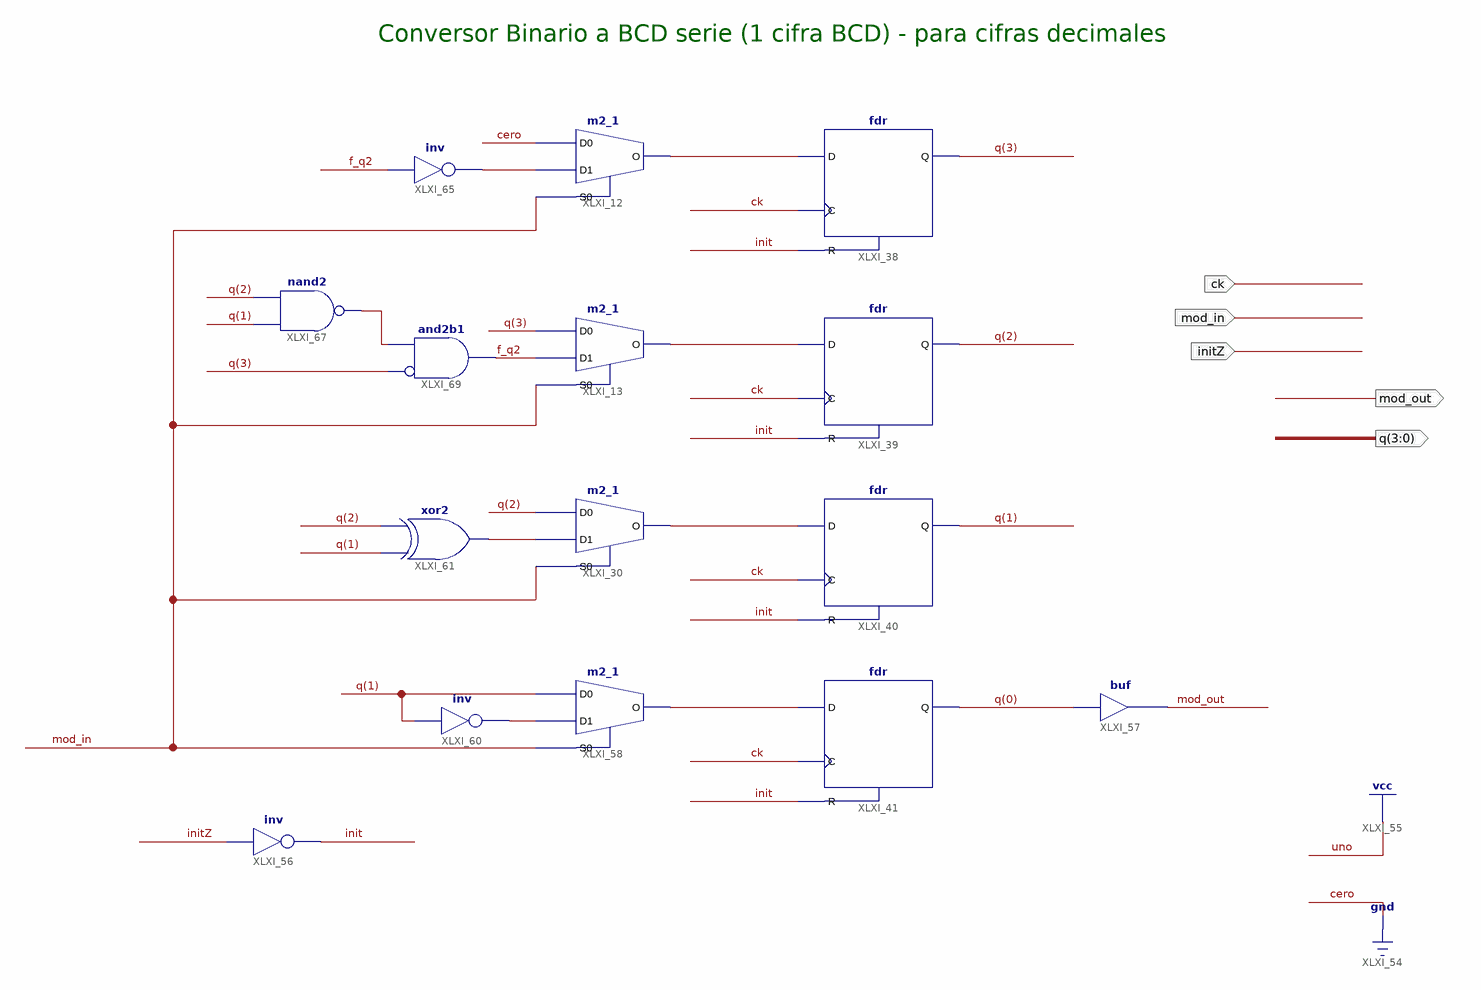
[diagram p0: schematic sheet 1]
// Xilinx ISE schematic Bin_A_BCD_decim.sch (spartan6) as structural Verilog: 15 symbols, 5 ports
module Bin_A_BCD_decim (
  input  initZ,
  input  ck,
  input  mod_in,
  output mod_out,
  output [3:0] q
);

  wire f_q2, init, XLXN_6, XLXN_7, XLXN_8, XLXN_50, XLXN_92, XLXN_97, XLXN_103, XLXN_110;

  fdr XLXI_39 (.C(ck), .D(XLXN_7), .R(init), .Q(q[2]));
  fdr XLXI_40 (.C(ck), .D(XLXN_8), .R(init), .Q(q[1]));
  fdr XLXI_41 (.C(ck), .D(XLXN_92), .R(init), .Q(q[0]));
  fdr XLXI_38 (.C(ck), .D(XLXN_6), .R(init), .Q(q[3]));
  m2_1 XLXI_13 (.D0(q[3]), .D1(f_q2), .S0(mod_in), .O(XLXN_7));
  m2_1 XLXI_30 (.D0(q[2]), .D1(XLXN_50), .S0(mod_in), .O(XLXN_8));
  m2_1 XLXI_12 (.D0(1'b0), .D1(XLXN_110), .S0(mod_in), .O(XLXN_6));
  buf XLXI_57 (mod_out, q[0]);
  m2_1 XLXI_58 (.D0(q[1]), .D1(XLXN_97), .S0(mod_in), .O(XLXN_92));
  not XLXI_56 (init, initZ);
  not XLXI_60 (XLXN_97, q[1]);
  xor XLXI_61 (XLXN_50, q[1], q[2]);
  not XLXI_65 (XLXN_110, f_q2);
  nand XLXI_67 (XLXN_103, q[1], q[2]);
  and XLXI_69 (f_q2, ~q[3], XLXN_103);  // and2b1

  // Notes on the sheet:
  //   Conversor Binario a BCD serie (1 cifra BCD) - para cifras decimales
endmodule
